# EAGLE design RobotRaceBSensor (EAGLE 7.7.0)
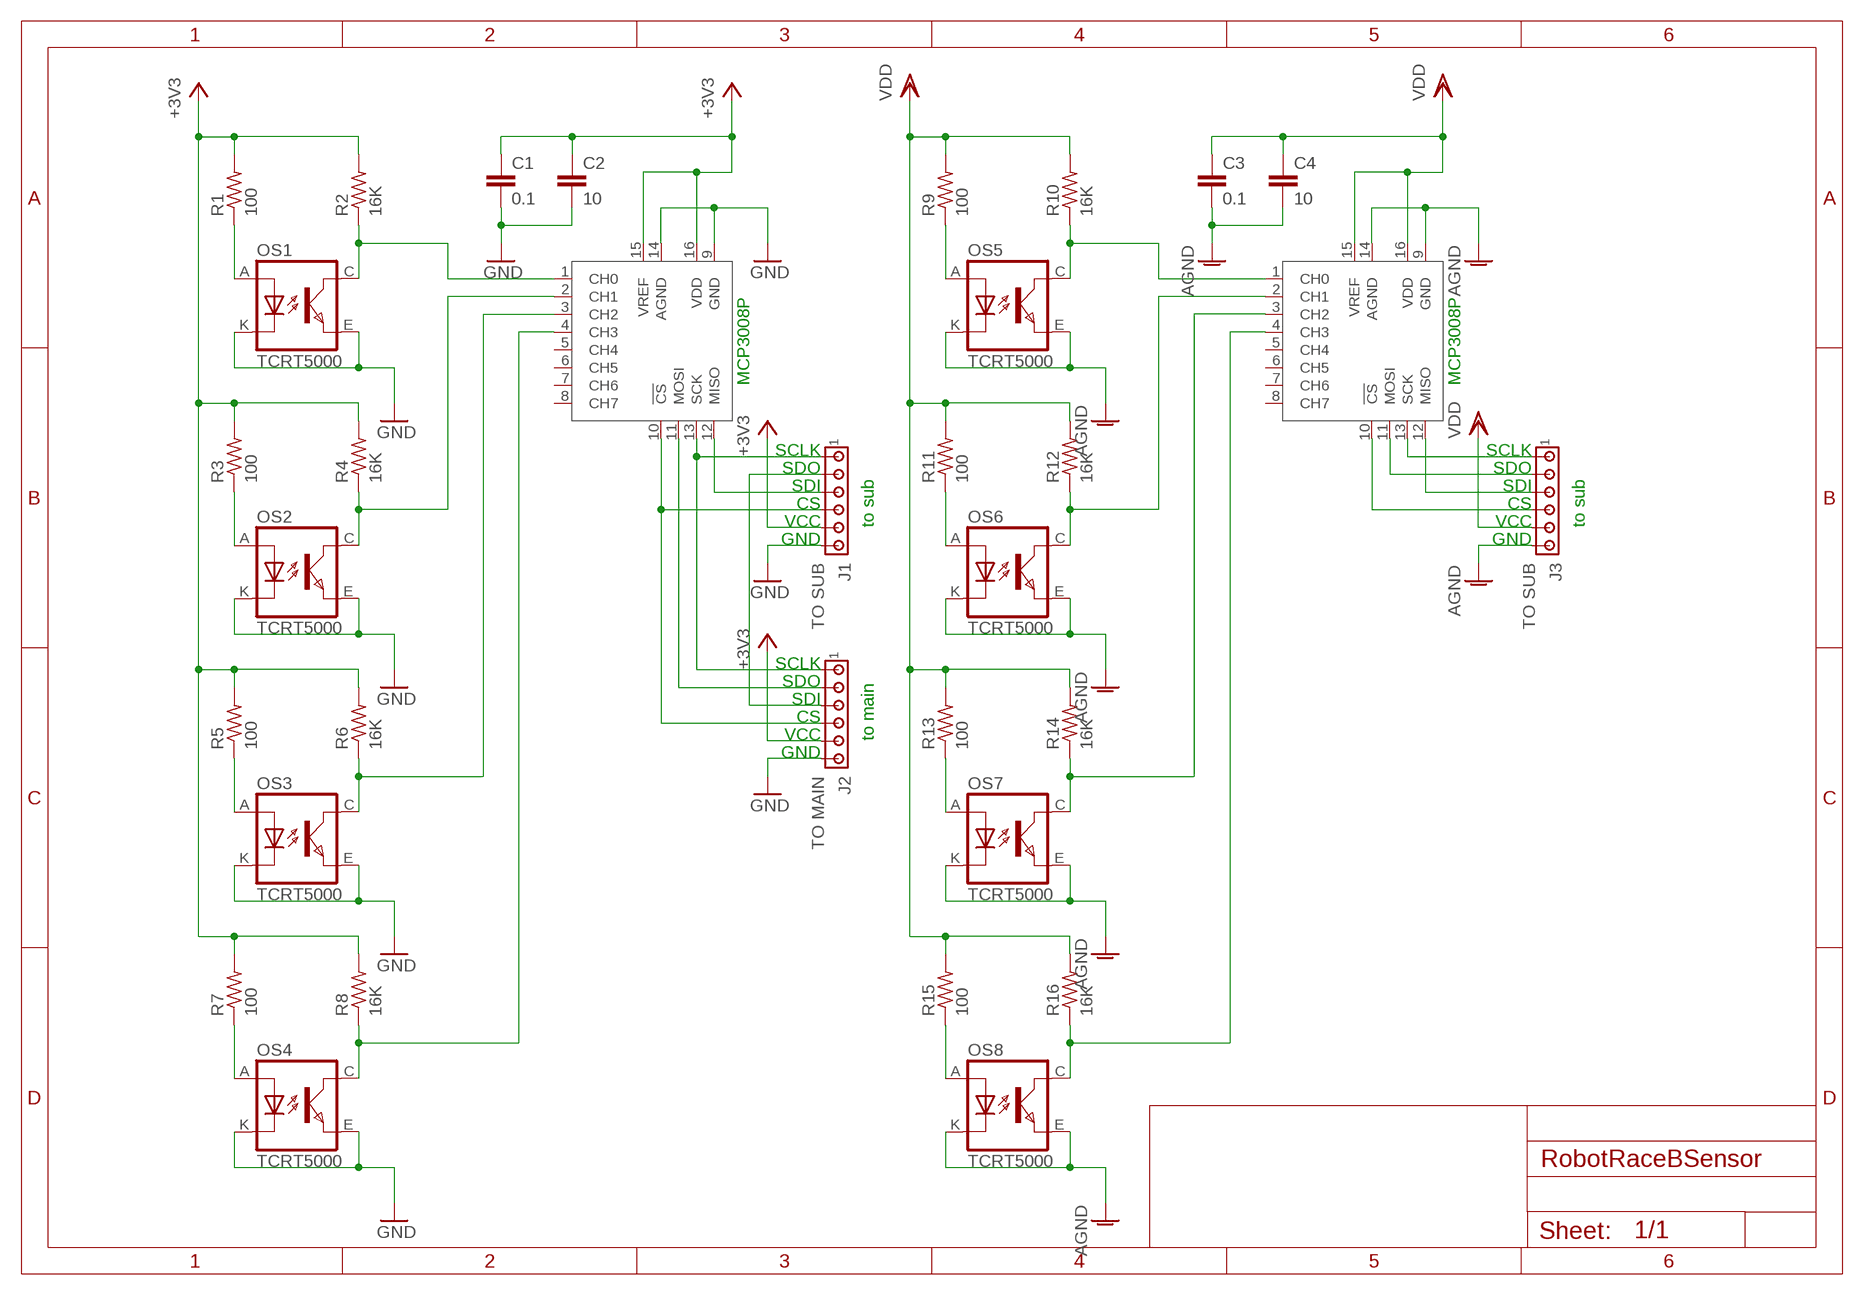
[diagram p0: schematic, sheet 1]

## Parts
C1  0.1  C  [C0805]
C2  10  C  [C0805]
C3  0.1  C  [C0805]
C4  10  C  [C0805]
J1  TO SUB  MTA06-100  [10X06MTA]
J2  TO MAIN  MTA06-100  [10X06MTA]
J3  TO SUB  MTA06-100  [10X06MTA]
OS1  TCRT5000  [TCRT5000]
OS2  TCRT5000  [TCRT5000]
OS3  TCRT5000  [TCRT5000]
OS4  TCRT5000  [TCRT5000]
OS5  TCRT5000  [TCRT5000]
OS6  TCRT5000  [TCRT5000]
OS7  TCRT5000  [TCRT5000]
OS8  TCRT5000  [TCRT5000]
R1  100  R-US_R0805  [R0805]
R2  16K  R-US_R0805  [R0805]
R3  100  R-US_R0805  [R0805]
R4  16K  R-US_R0805  [R0805]
R5  100  R-US_R0805  [R0805]
R6  16K  R-US_R0805  [R0805]
R7  100  R-US_R0805  [R0805]
R8  16K  R-US_R0805  [R0805]
R9  100  R-US_R0805  [R0805]
R10  16K  R-US_R0805  [R0805]
R11  100  R-US_R0805  [R0805]
R12  16K  R-US_R0805  [R0805]
R13  100  R-US_R0805  [R0805]
R14  16K  R-US_R0805  [R0805]
R15  100  R-US_R0805  [R0805]
R16  16K  R-US_R0805  [R0805]
U$1  MCP3008P  [DIL16]
U$2  MCP3008P  [DIL16]

## Nets
+3V3 [Power]: C1.1 C2.1 J1.5 J2.5 R1.2 R2.2 R3.2 R4.2 R5.2 R6.2 R7.2 R8.2 U$1.15(VREF) U$1.16(VDD)
AGND [GND]: C3.2 C4.2 J3.6 OS5.E(EMITTER) OS5.K(CATHODE) OS6.E(EMITTER) OS6.K(CATHODE) OS7.E(EMITTER) OS7.K(CATHODE) OS8.E(EMITTER) OS8.K(CATHODE) U$2.9(GND) U$2.14(AGND)
GND [GND]: C1.2 C2.2 J1.6 J2.6 OS1.E(EMITTER) OS1.K(CATHODE) OS2.E(EMITTER) OS2.K(CATHODE) OS3.E(EMITTER) OS3.K(CATHODE) OS4.E(EMITTER) OS4.K(CATHODE) U$1.9(GND) U$1.14(AGND)
N$1: OS1.A(ANODE) R1.1
N$2: OS1.C(COLLECTOR) R2.1 U$1.1(CH0)
N$3: J1.1 J2.1 U$1.13(SCK)
N$4: OS2.A(ANODE) R3.1
N$5: OS2.C(COLLECTOR) R4.1 U$1.2(CH1)
N$6: J1.3 U$1.12(MISO)
N$7: OS3.A(ANODE) R5.1
N$8: OS3.C(COLLECTOR) R6.1 U$1.3(CH2)
N$9: J1.2 J2.3
N$10: OS4.A(ANODE) R7.1
N$11: OS4.C(COLLECTOR) R8.1 U$1.4(CH3)
N$12: J1.4 J2.4 U$1.10(!CS)
N$13: J2.2 U$1.11(MOSI)
N$14: OS5.A(ANODE) R9.1
N$15: OS5.C(COLLECTOR) R10.1 U$2.1(CH0)
N$16: OS6.A(ANODE) R11.1
N$17: OS6.C(COLLECTOR) R12.1 U$2.2(CH1)
N$18: OS7.A(ANODE) R13.1
N$19: OS7.C(COLLECTOR) R14.1 U$2.3(CH2)
N$20: OS8.A(ANODE) R15.1
N$21: OS8.C(COLLECTOR) R16.1 U$2.4(CH3)
N$22: J3.1 U$2.13(SCK)
N$23: J3.3 U$2.12(MISO)
N$24: J3.2 U$2.11(MOSI)
N$25: J3.4 U$2.10(!CS)
VDD [Power]: C3.1 C4.1 J3.5 R9.2 R10.2 R11.2 R12.2 R13.2 R14.2 R15.2 R16.2 U$2.15(VREF) U$2.16(VDD)
Unconnected: U$1.5(CH4) U$1.6(CH5) U$1.7(CH6) U$1.8(CH7) U$2.5(CH4) U$2.6(CH5) U$2.7(CH6) U$2.8(CH7)

## Notes on the sheet
- MCP3008P | MCP3008P
- SCLK | SCLK
- SDO | SDO
- SDI | SDI
- CS | CS
- VCC | to sub | VCC | to sub
- GND | GND
- SCLK
- SDO
- SDI
- CS
- VCC | to main
- GND

## Library data of the parts
C1-C4 = 0my_lbr:C: CAPACITOR, European symbol; SPICEMODEL: NONE; SPICEPREFIX: C
J1-J3 = 0my_lbr:MTA06-100: AMP connector Connection corrected 2014-09-19
OS1-OS8 = tcrt5000:TCRT5000
R1-R16 = 0my_lbr:R-US_: RESISTOR, American symbol
U$1 U$2 = MCP3008:MCP3008

## Net classes
1 GND: width 0.203 mm
2 Power: width 0.61 mm
3 VBAT: width 0.762 mm, clearance 0.381 mm
4 VDD: width 0.762 mm, clearance 0.381 mm

## Board
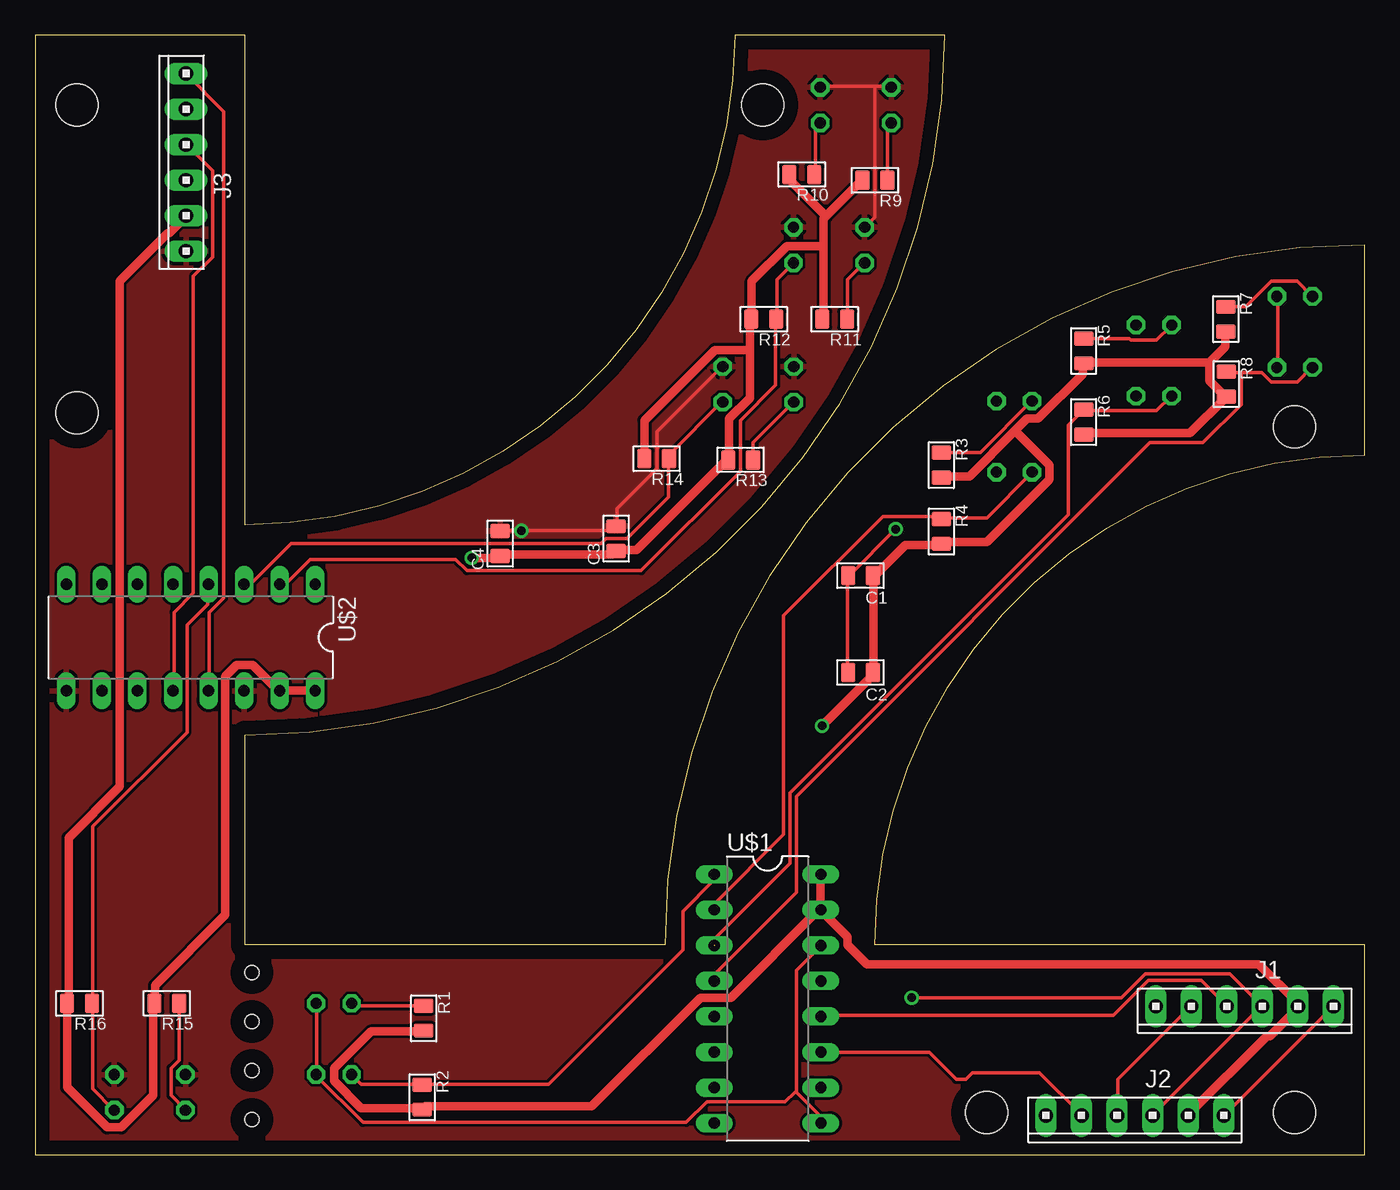
[diagram p1: board, top side]
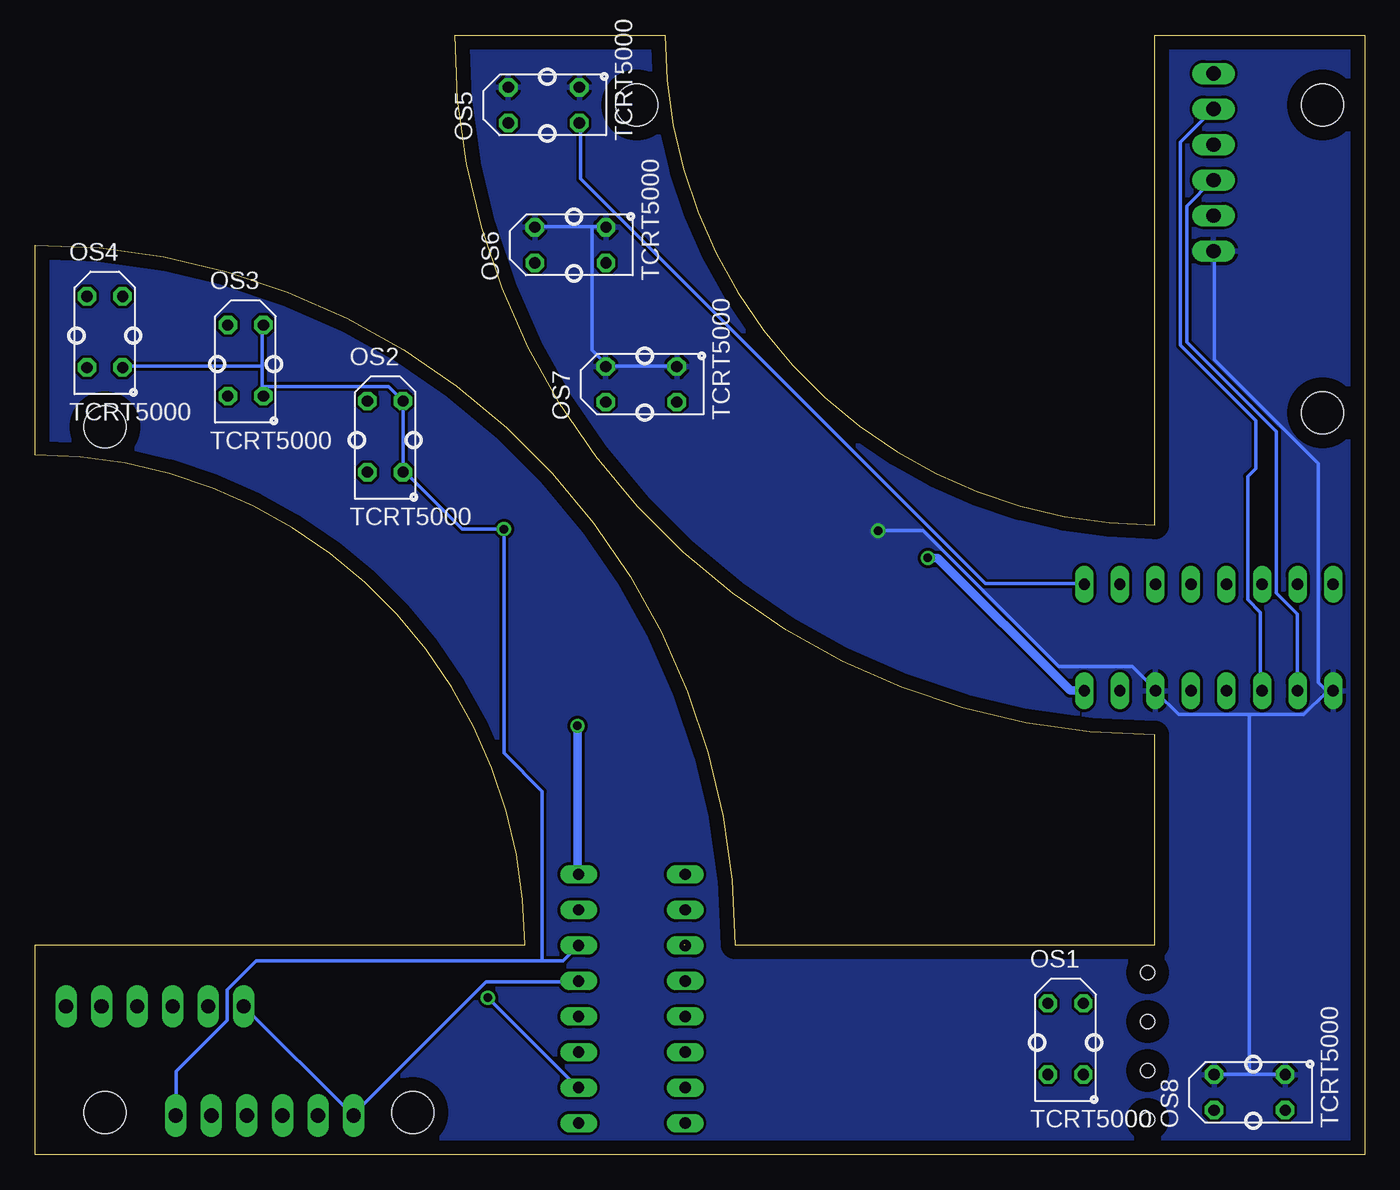
[diagram p2: board, bottom side, seen from below]

Size 95 x 80 mm. Coordinates in mm from the lower left corner, seen from the top.
Outline: 0,0 95,0 95,15 60,15 arc-90 95,50 95,65 arc90 45,15 15,15 15,30 arc90 65,80 50,80 arc-90 15,45 15,80 0,80 0,0
Copper layers (1*16): Top 0.035mm / dielectric 1.5mm / Bottom 0.035mm
Design rules "default": minimum track width 10mil, minimum drill 24mil, track to track 8mil, track to pad 8mil, pad to pad 8mil, via to via 8mil, smd to smd 8mil, copper to edge 40mil, drill to drill 8mil, minimum pad ring 10mil, minimum via ring 8mil, stop-mask expansion 4mil, vias tented up to drill 0mil, thermal gap 10mil
Holes 3 mm at 90,3 68,3 90,52 52,75 3,75 3,53
Holes 1 mm at 15.5,13 15.5,9.5 15.5,6 15.5,2.5

### Footprints (pad centres in the part's own frame; a part is rotated, then mirrored left to right if it is on the bottom)
C0805 = smd 1.397 x 1.016: 1 0,0.889; 2 0,-0.889
10X06MTA = drill 1.016 long: 1 6.35,0; 2 3.81,0; 3 1.27,0; 4 -1.27,0; 5 -3.81,0; 6 -6.35,0
TCRT5000 = drill 0.8 octagon: A -2.54,-1.27; C 2.54,-1.27; E 2.54,1.27; K -2.54,1.27
R0805 = smd 1.397 x 1.016: 1 0,0.889; 2 0,-0.889
DIL16 = drill 0.813 long: 1 -8.89,-3.81; 2 -6.35,-3.81; 3 -3.81,-3.81; 4 -1.27,-3.81; 5 1.27,-3.81; 6 3.81,-3.81; 7 6.35,-3.81; 8 8.89,-3.81; 9 8.89,3.81; 10 6.35,3.81; 11 3.81,3.81; 12 1.27,3.81; 13 -1.27,3.81; 14 -3.81,3.81; 15 -6.35,3.81; 16 -8.89,3.81

### Placement (x,y rotation side)
C1  58.99,41.37 270 top
C2  58.99,34.45 270 top
C3  41.53,44.01 180 top
C4  33.24,43.66 180 top
J1  86.44,10.59 180 top
J2  78.59,2.79 180 top
J3  10.79,70.9 90 top
OS1  21.36,8.26 270 bottom
OS2  69.97,51.3 270 bottom
OS3  79.95,56.73 270 bottom
OS4  90.01,58.78 270 bottom
OS5  58.65,74.99 0 bottom
OS6  56.74,64.99 0 bottom
OS7  51.68,55.04 0 bottom
OS8  8.21,4.44 0 bottom
R1  27.78,9.74 0 top
R2  27.67,4.09 0 top
R3  64.77,49.27 0 top
R4  64.77,44.52 0 top
R5  74.93,57.42 0 top
R6  74.93,52.34 0 top
R7  85.09,59.69 0 top
R8  85.12,55.05 0 top
R9  60.02,69.62 270 top
R10  54.78,70.03 270 top
R11  57.15,59.69 270 top
R12  52.07,59.69 270 top
R13  50.42,49.64 270 top
R14  44.42,49.72 270 top
R15  9.42,10.8 270 top
R16  3.17,10.79 270 top
U$1  52.35,11.13 270 top
U$2  11.13,36.95 180 top

### Tracks (layer width: path | path; a pad name or v marks a point on that pad's centre or on a via)
+3V3  (via drill 0.61)
  Top 0.61: R6.2 74.98,51.55 82.53,51.55 85.04,54.06 R8.2 84.92,54.29 83.9,55.32 83.9,56.58 | 83.9,56.58 85.04,57.72 85.04,58.75 R7.2 | 70.01,51.72 70.87,52.58 71.67,52.58 74.87,55.78 74.87,56.46 R5.2 75.21,56.58 83.9,56.58 | 70.01,51.72 66.75,48.46 64.81,48.46 R3.2 | J2.5 82.41,2.86 88.01,8.46 88.24,8.46 90.3,10.52 J1.5 90.18,10.86 87.44,13.6 59.44,13.6 58.06,14.97 58.06,15.54 56.35,17.26 U$1.15 | R1.2 27.77,8.8 24,8.8 21.37,6.17 21.37,5.26 23.32,3.31 27.66,3.31 R2.2 27.89,3.43 39.78,3.43 47.55,11.2 49.72,11.2 55.89,17.37 U$1.15 | U$1.15 56.12,17.49 56.12,20 U$1.16 | v56.24,30.63 59.78,34.18 C2.1 59.89,34.52 59.89,41.26 C1.1 60.12,41.49 62.18,43.55 64.69,43.55 R4.2 65.04,43.78 68.01,43.78 72.47,48.23 72.47,49.26 70.01,51.72
  Bottom 0.61: v56.24,30.63 56.24,20.12 U$1.16
AGND  (via drill 0.61)
  Top 0.254: 60.01,76.35 61.15,76.35 OS5.K | 60.01,76.35 56.12,76.35 OS5.E | C4.2 33.26,44.58 v34.75,44.58 41.26,44.58 41.49,44.81 C3.2 41.6,44.92 41.6,46.18 44.46,49.03 44.46,51.66 49.03,56.24 OS7.E | 60.01,76.35 60.01,66.98 59.32,66.29 OS6.K
  Bottom 0.254: 55.21,66.29 59.21,66.29 OS6.K | 55.21,66.29 54.29,66.29 OS6.E | OS7.E 49.15,56.35 54.18,56.35 OS7.K 54.18,56.46 55.21,57.49 55.21,66.29 | 8.23,5.71 OS8.K | 8.23,5.71 5.71,5.71 OS8.E | 8.23,31.43 13.26,31.43 14.86,33.03 U$2.14 14.97,33.26 16.57,34.86 21.83,34.86 31.55,44.58 v34.75,44.58 | 8.23,31.43 4.34,31.43 2.74,33.03 2.29,33.03 U$2.9 2.74,33.15 3.31,33.72 3.31,49.38 10.74,56.81 10.74,64.47 J3.6 | 8.23,31.43 8.23,5.71
  pour Bottom: -11,97 109,97 109,-5 -11,-5
  pour Top (rank 2): -25,84 108,84 108,-4 -25,-4
GND  (via drill 0.61)
  Top 0.254: OS4.E 88.81,56.35 88.81,61.27 OS4.K | C2.2 58.06,34.52 58.06,41.26 C1.2 58.18,41.38 v61.49,44.69 | J2.6 85.04,2.86 92.7,10.52 J1.6 | OS1.K 20.12,10.74 20.12,5.83 OS1.E 20.12,5.6 23.43,2.29 46.52,2.29 48.01,3.77 53.61,3.77 54.29,4.46 54.41,4.46 | 54.41,4.46 56.12,2.74 56.12,2.29 U$1.9 | 54.41,4.46 54.41,13.14 56.12,14.86 U$1.14
  Bottom 0.254: 78.75,56.35 78.75,59.21 OS3.K | 78.75,56.35 78.75,54.86 | 78.75,54.86 78.75,54.29 OS3.E | 78.75,56.35 88.7,56.35 OS4.E | 78.75,54.86 69.72,54.86 68.81,53.95 OS2.K 68.69,48.81 OS2.E 68.58,48.81 64.47,44.69 v61.49,44.69 61.49,28.69 58.75,25.95 58.75,13.83 | 58.75,13.83 57.26,13.83 56.24,14.86 U$1.14 | 58.75,13.83 79.21,13.83 81.27,11.77 81.27,9.6 84.92,5.94 84.92,2.86 J2.6
N$1
  Top 0.254: R1.1 22.75,10.63 22.63,10.74 OS1.A
N$2
  Top 0.254: OS1.C 23.32,5.03 27.66,5.03 R2.1 27.77,5.03 36.69,5.03 46.29,14.63 46.29,17.37 48.46,19.55 48.46,20 U$1.1
N$3
  Bottom 0.254: U$1.13 56.24,12.34 62.75,12.34 72.24,2.86 J2.1 72.35,2.86 80.01,10.52 J1.1
N$4
  Top 0.254: R3.1 64.81,50.18 67.55,50.18 71.21,53.84 OS2.A
N$5
  Top 0.254: OS2.C 71.21,48.69 68.01,45.49 64.81,45.49 R4.1 64.81,45.61 60.58,45.61 53.49,38.52 53.49,22.86 48.58,17.95 48.58,17.49 U$1.2
N$6
  Top 0.254: U$1.12 56.24,9.94 77.04,9.94 79.55,12.46 83.33,12.46 85.15,10.63 J1.3
N$7
  Top 0.254: R5.1 74.98,58.29 78.18,58.29 78.3,58.18 80.12,58.18 81.15,59.21 OS3.A
N$8  (1 unrouted)
  Top 0.254: OS3.C 81.15,54.18 80.12,53.15 74.98,53.15 R6.1 74.87,53.15 73.84,52.12 73.84,45.72 53.95,25.83 53.95,20.8 48.58,15.43 48.58,14.97
N$9
  Top 0.254: J2.3 77.38,2.86 77.38,5.37 82.53,10.52 J1.2
N$10
  Top 0.254: R7.1 86.53,60.58 88.35,62.41 90.18,62.41 91.21,61.38 OS4.A
N$11
  Top 0.254: 86.18,55.89 87.67,55.89 88.35,55.21 90.18,55.21 91.21,56.24 OS4.C | 86.18,55.89 85.15,55.89 R8.1 | 86.18,55.89 86.18,53.61 83.44,50.86 79.67,50.86 54.41,25.6 54.41,18.75 48.58,12.92 48.58,12.46 U$1.4
N$12  (via drill 0.61)
  Top 0.254: v62.64,11.2 77.61,11.2 79.32,12.92 85.38,12.92 87.67,10.63 | 87.67,10.63 79.9,2.86 J2.4 | 87.67,10.63 J1.4
  Bottom 0.254: v62.64,11.2 56.24,4.8 U$1.10
N$13
  Top 0.254: U$1.11 56.24,7.32 63.89,7.32 65.84,5.37 66.52,5.37 66.98,5.83 71.78,5.83 74.75,2.86 J2.2
N$14
  Top 0.254: R9.1 60.92,69.72 60.92,73.38 61.15,73.61 OS5.A
N$15
  Top 0.254: R10.1 55.78,70.07 55.78,73.38 56.01,73.61 OS5.C
  Bottom 0.254: U$2.1 20.12,40.8 27.09,40.8 56.01,69.72 56.01,73.61 OS5.C
N$16
  Top 0.254: R11.1 58.06,59.78 58.06,62.52 59.21,63.66 OS6.A
N$17
  Top 0.254: OS6.C 54.18,63.66 53.03,62.52 53.03,59.78 R12.1 52.92,59.66 52.92,54.98 50.41,52.46 50.41,48.81 43.32,41.72 30.86,41.72 30.06,42.52 19.66,42.52 17.95,40.8 17.49,40.8 U$2.2
N$18
  Top 0.254: R13.1 51.32,49.72 51.32,50.86 54.18,53.72 OS7.A
N$19
  Top 0.254: OS7.C 49.03,53.72 45.38,50.06 45.38,49.72 R14.1 45.26,49.61 45.26,46.98 42.29,44.01 40.8,44.01 40.46,43.66 18.29,43.66 15.43,40.8 14.97,40.8 U$2.3
N$20
  Top 0.254: R15.1 10.29,10.74 10.29,6.74 9.72,6.17 9.72,4.23 10.74,3.2 OS8.A
N$21
  Top 0.254: OS8.C 5.6,3.2 4.12,4.69 4.12,10.74 R16.1 4.12,10.86 4.12,23.43 10.86,30.18 10.86,37.83 12.34,39.32 12.34,40.69 U$2.4
N$22
  Top 0.254: U$2.13 12.46,33.15 12.46,38.75 13.49,39.78 13.49,74.52 10.86,77.15 J3.1
N$23
  Top 0.254: U$2.12 9.94,33.15 9.94,38.75 11.32,40.12 11.32,62.75 12.69,64.12 12.69,70.29 10.86,72.12 J3.3
N$24
  Bottom 0.254: U$2.11 7.43,33.15 7.43,38.75 8.34,39.66 8.34,48.46 7.77,49.03 7.77,52.46 13.14,57.84 13.14,72.35 10.86,74.64 J3.2
N$25
  Bottom 0.254: U$2.10 4.8,33.15 4.8,38.63 6.29,40.12 6.29,51.66 12.69,58.06 12.69,67.78 10.86,69.61 J3.4
VDD  (via drill 0.61)
  Top 0.61: 56.35,64.92 56.35,66.86 56.52,67.04 | 56.35,64.92 56.35,59.78 R11.2 | 56.52,67.04 59.09,69.61 R9.2 | 56.52,67.04 53.95,69.61 53.95,69.95 R10.2 | 51.09,57.49 51.09,59.66 R12.2 51.21,60.01 51.21,62.41 53.72,64.92 56.35,64.92 | 51.09,57.49 51.09,54.06 49.61,52.58 49.61,49.72 R13.2 49.26,49.49 42.98,43.2 41.83,43.2 C3.1 41.49,43.09 41.26,42.86 33.26,42.86 C4.1 33.03,42.63 v31.2,42.63 | 51.09,57.49 48.58,57.49 43.55,52.46 43.55,49.72 R14.2 | U$2.16 20,33.15 U$2.15 17.26,33.26 15.54,34.98 14.4,34.98 13.6,34.18 13.6,17.12 8.57,12.09 R15.2 8.46,10.74 8.46,4.23 6.17,1.94 5.14,1.94 2.29,4.8 R16.2 2.4,11.09 2.4,22.63 6.06,26.29 6.06,62.41 9.49,65.84 9.6,65.84 10.74,66.98 J3.5
  Bottom 0.61: v31.2,42.63 30.52,42.63 21.03,33.15 20.12,33.15 U$2.16

### Text on the board
silk_top: to Sub | to Sub | to Main